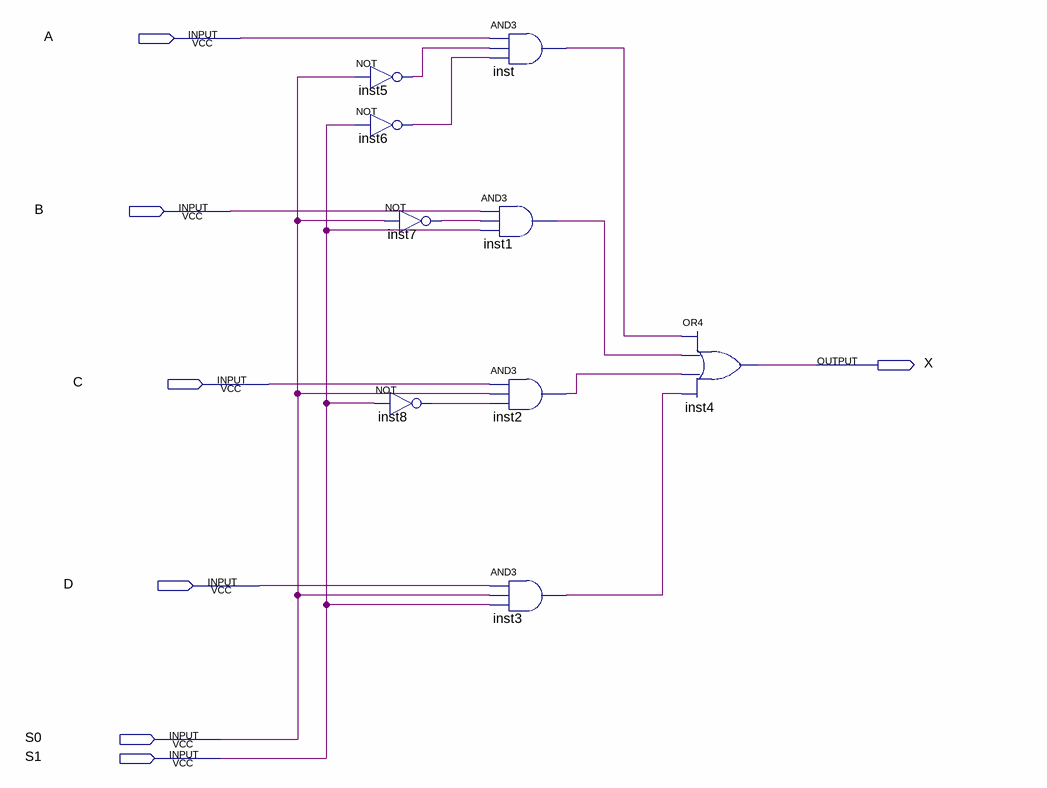
[diagram p0: schematic sheet]
// Quartus schematic MUX4BITS.bdf as structural Verilog: 9 symbols, 7 pins
module MUX4BITS (
  input  A,
  input  B,
  input  C,
  input  D,
  input  S0,
  input  S1,
  output X
);

  wire inst1_out, inst2_out, inst3_out, inst5_out, inst6_out, inst7_out, inst8_out, inst_out;

  not inst5 (inst5_out, S0);
  not inst6 (inst6_out, S1);
  not inst7 (inst7_out, S0);
  not inst8 (inst8_out, S1);
  and inst (inst_out, A, inst5_out, inst6_out);
  and inst1 (inst1_out, B, inst7_out, S1);
  and inst2 (inst2_out, C, S0, inst8_out);
  and inst3 (inst3_out, D, S0, S1);
  or inst4 (X, inst_out, inst1_out, inst2_out, inst3_out);
endmodule
